# Altium project HVBoard.PrjPCB
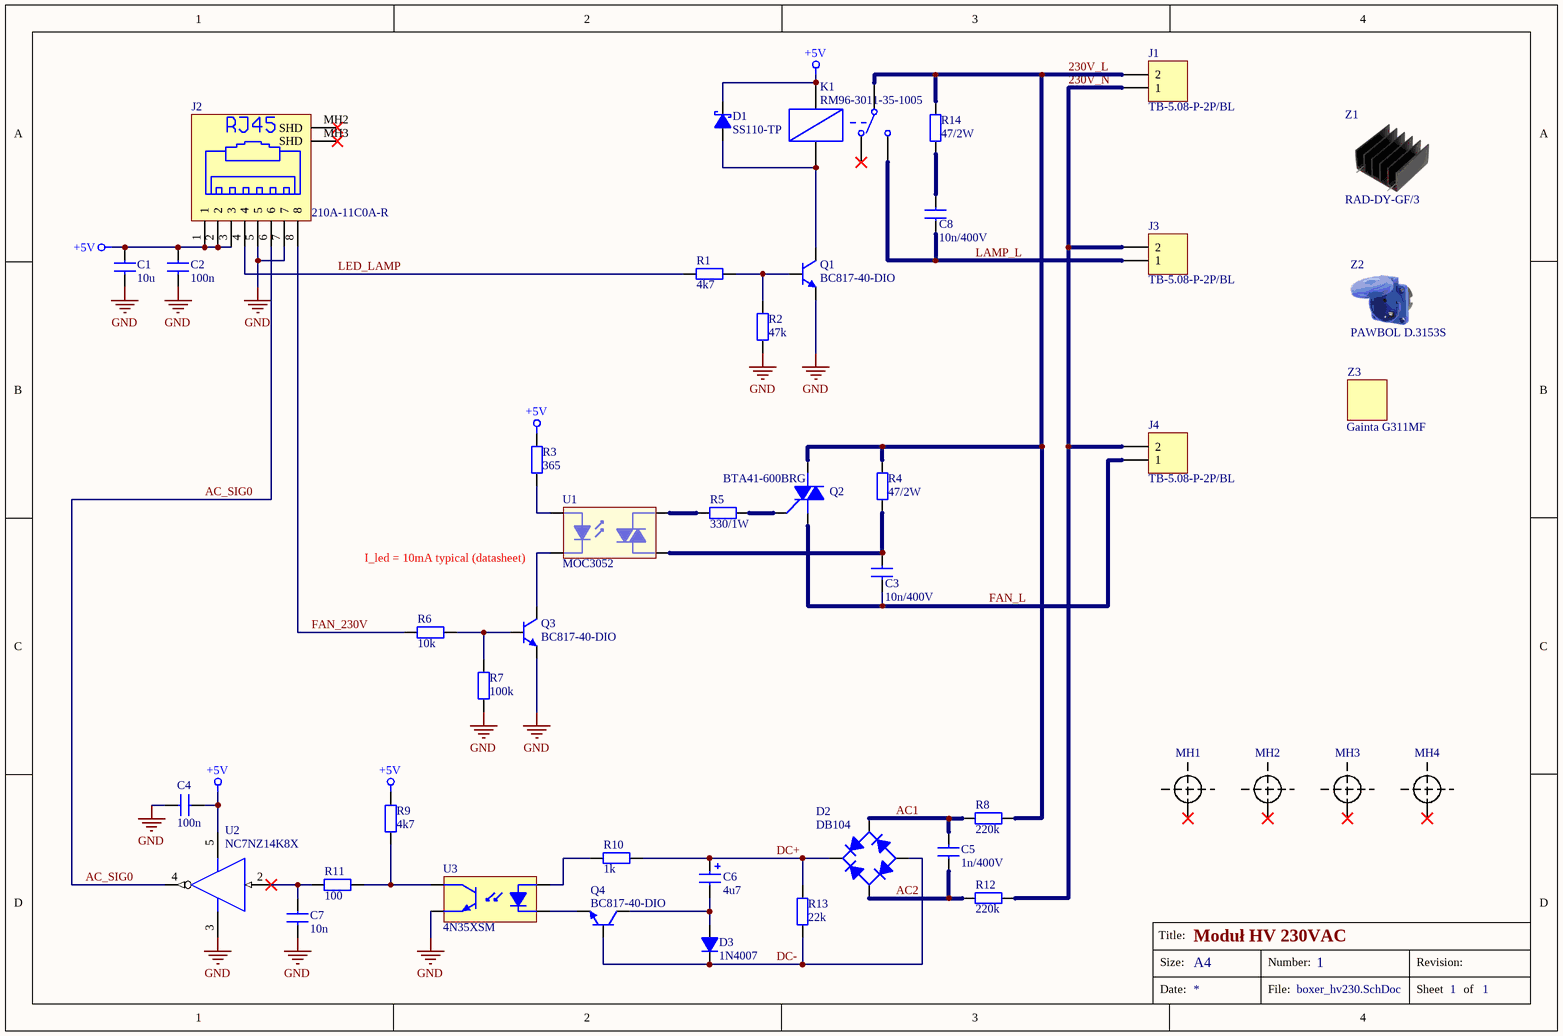
[diagram p0: boxer_hv230.SchDoc]
.revision: 1.0
1 sheet, 44 parts. Net scope: global (net labels, ports and power ports of the same name join across sheets).
Board file: PCB.PcbDoc

## Sheet boxer_hv230.SchDoc: Moduł HV 230VAC
size A4; DrawnBy: Damian Dolewski; Engineer: Damian Dolewski; DocumentNumber: 1; Revision: 1.0; SheetNumber: 1; SheetTotal: 1

### Parts
C1  value 10u  [C_1206]  (hidden comment: Capacitor)
C2  value 100n  [C_0805]  (hidden comment: Capacitor)
C3  value 10n/400V  [CAP_7.5mm]  (hidden comment: C212G103K3AA31A)
C4  value 100n  [C_0805]  (hidden comment: Capacitor)
C5  value 1n/400V  [RAD-0.4]  (hidden comment: Capacitor)
C6  value 4u7  [C_SMC]  (hidden comment: Capacitor Polar)
C7  value 10n  [C_0805]  (hidden comment: Capacitor)
C8  value 10n/400V  [CAP_7.5mm]  (hidden comment: C212G103K3AA31A)
D1  SS110-TP  [D_SMA]
D2  DB104  [DB10x]
D3  1N4007  [D_SMA]
J1  TB-5.08-P-2P/BL  [NINIGI TB-5.08 2pin]
J2  210A-11C0A-R  [RJ45-8_SHIELDED]
J3  TB-5.08-P-2P/BL  [NINIGI TB-5.08 2pin]
J4  TB-5.08-P-2P/BL  [NINIGI TB-5.08 2pin]
K1  RM96-3011-35-1005  [RM96_1P]
MH1  Mounting hole  [MH_M3_UNVIA]  (value not drawn)
MH2  Mounting hole  [MH_M3_UNVIA]  (value not drawn)
MH3  Mounting hole  [MH_M3_UNVIA]  (value not drawn)
MH4  Mounting hole  [MH_M3_UNVIA]  (value not drawn)
Q1  BC817-40-DIO  [SOT-23]
Q2  BTA41-600BRG  [TO-247]
Q3  BC817-40-DIO  [SOT-23]
Q4  BC817-40-DIO  [SOT-23]
R1  value 4k7  [R_0805]  (hidden comment: Resistor)
R2  value 47k  [R_0805]  (hidden comment: Resistor)
R3  value 365  [R_0805]  (hidden comment: Resistor)
R4  value 47/2W  [AXIAL-0.8]  (hidden comment: RB-2W-47R)
R5  value 330/1W  [330R 3x9mm]  (hidden comment: electropark.pl: 6618)
R6  value 10k  [R_1206]  (hidden comment: Resistor)
R7  value 100k  [R_0805]  (hidden comment: Resistor)
R8  value 220k  [220k 1.8x3.5]  (hidden comment: Resistor)
R9  value 4k7  [R_0805]  (hidden comment: Resistor)
R10  value 1k  [R_0805]  (hidden comment: Resistor)
R11  value 100  [R_0805]  (hidden comment: Resistor)
R12  value 220k  [220k 1.8x3.5]  (hidden comment: Resistor)
R13  value 22k  [R_0805]  (hidden comment: Resistor)
R14  value 47/2W  [AXIAL-0.8]  (hidden comment: RB-2W-47R)
U1  MOC3052  [DIP-6]
U2  NC7NZ14K8X  [SOP5(6)]
U3  4N35XSM  [SOP6]
Z1  RAD-DY-GF/3  [Radiator]
Z2  PAWBOL D.3153S  (mechanical)
Z3  Gainta G311MF  [Gainta G311MF]

### Nets
+5V: C1.2 C2.1 C4.1 D1.2(K) J2.1 J2.2 J2.3 K1.1(A1) R3.2 R9.2 U2.5(VCC)
GND: C1.1 C2.2 C4.2 C7.1 J2.5 J2.7 Q1.2(E) Q3.2(E) R2.1 R7.1 U2.3(GND) U3.4(E)
230V_L: J1.2 K1.4 Q2.1(M1) R4.2 R8.1 R14.2
230V_N: J1.1 J3.2 J4.2 R12.1
AC1: C5.2 D2.4(C) R8.2
AC2: C5.1 D2.2(C) R12.2
AC_SIG0: J2.6 U2.4(Y)
DC+: C6.1 D2.1(K) R10.2 R13.2
DC-: D2.3(A) D3.2(K) Q4.1(B) R13.1
FAN_230V: J2.8 R6.1
FAN_L: C3.1 J4.1 Q2.2(M2)
LAMP_L: C8.1 J3.1 K1.5
LED_LAMP: J2.4 R1.1
NetC3_2: C3.2 R4.1 U1.4(A/K)
NetC6_2: C6.2 D3.1(A) Q4.3(C)
NetC7_2: C7.2 R11.2 U2.2(A)
NetC8_2: C8.2 R14.1
NetD1_1: D1.1(A) K1.2(A2) Q1.3(C)
NetQ1_1: Q1.1(B) R1.2 R2.2
NetQ2_3: Q2.3(G) R5.2
NetQ3_1: Q3.1(B) R6.2 R7.2
NetQ3_3: Q3.3(C) U1.2(K)
NetQ4_2: Q4.2(E) U3.2(K)
NetR3_1: R3.1 U1.1(A)
NetR5_1: R5.1 U1.6(A/K)
NetR9_1: R9.1 R11.1 U3.3(C)
NetR10_1: R10.1 U3.1(A)

Not connected (* = marked no-connect by the designer): J2 MH2(SHD)* MH3(SHD)*; K1 3(12)*; MH1 MH*; MH2 MH*; MH3 MH*; MH4 MH*; U2 1(NC)

### Notes on the sheet
- (near U1) I_led = 10mA typical (datasheet)
- Title:
- Size:
- A4
- Number:
- Revision:
- Date:
- File:
- Sheet
- of

### Library data of the parts
C3 C8 = Capacitor
C6 = Capacitor Polar: Polarized Capacitor
D1 = Diode Schottky: Schottky Diode; Value: SS110-TP
D2 = Graetz Bridge: Full Wave Diode Bridge; Value: DB104
D3 = Diode: Value: 1N4007
J1 J3 J4 = Header 2: Terminal Block; Value: TB-5.08-P-2P/BL
J2 = RJ45-8: RJ45 Socket, 8pin, shielded; Value: 210A-11C0A-R
K1 = Relay: Electromagnetic Relay; Value: RM96-3011-35-1005
MH1-MH4 = Mounting hole: Mounting hole 2.3mm
Q1 Q3 Q4 = NPN: NPN Bipolar Transistor; Value: BC817-40-DIO
Q2 = Triac: Value: BTA41-600BRG
R4 R5 R14 = Resistor
U1 = Triac Opto: Opto-Triac; Value: MOC3052
U2 = NOT Schmitt: TinyLogic ULP Inverter with Schmitt Trigger Input; Value: NC7NZ14K8X
U3 = Optocoupler: Value: 4N35XSM
Z3 = G311MF: Value: Gainta G311MF